# EAGLE schematic FMoto-Schematic (EAGLE 8.5.2)

## Sheet 1 of 2: HDK Interface & Identification
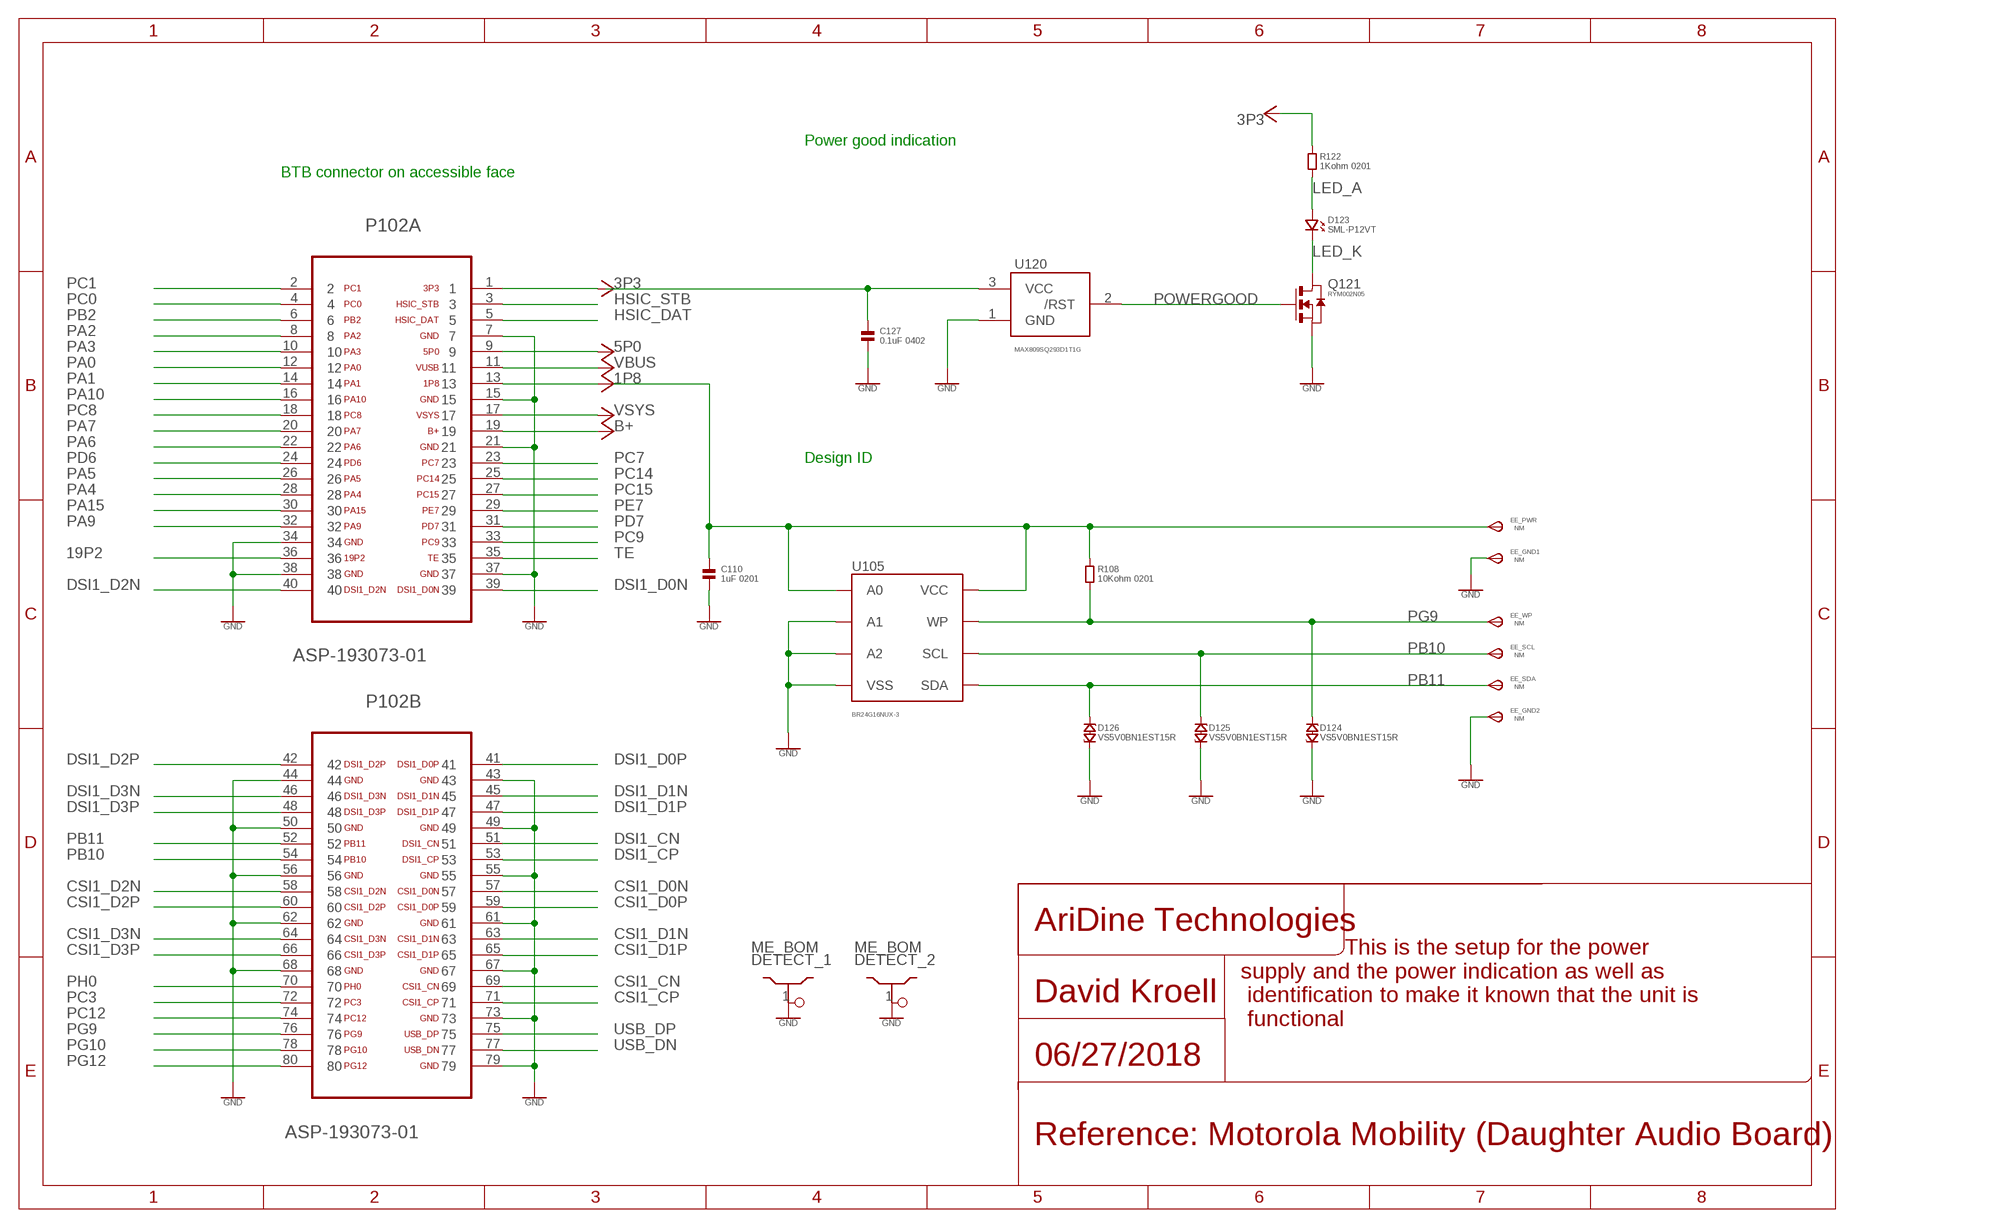
[diagram p0: schematic, sheet 1]

### Parts
C110  1uF 0201  CAPACITOR.0201  [0201]
C127  0.1uF 0402  CAPACITOR.0402  [0402]
D123  SML-P12VT  LED.0503  [0503.LED]
D124  VS5V0BN1EST15R  ESD_VARISTOR.0201  [CHIP_0201]
D125  VS5V0BN1EST15R  ESD_VARISTOR.0201  [CHIP_0201]
D126  VS5V0BN1EST15R  ESD_VARISTOR.0201  [CHIP_0201]
DETECT_1  ME_BOM  SHIELDDETECT  [PLUG]
DETECT_2  ME_BOM  SHIELDDETECT  [PLUG]
EE_GND1  NM  TPSTP11R  [TP11R]
EE_GND2  NM  TPSTP11R  [TP11R]
EE_PWR  NM  TPSTP11R  [TP11R]
EE_SCL  NM  TPSTP11R  [TP11R]
EE_SDA  NM  TPSTP11R  [TP11R]
EE_WP  NM  TPSTP11R  [TP11R]
P102  ASP-193073-01  FTMH-140-02-L-DV-ES-P-TR  [FTMH-140-02-L-DV-ES-P-TR]
Q121  RYM002N05  FET-NRYM002N05  [VMT3]
R108  10Kohm 0201  RESISTOR.0201  [0201]
R122  1Kohm 0201  RESISTOR.0201  [0201]
U105  BR24G16NUX-3  EEPROMDFN8  [DFN-8]
U120  MAX809SQ293D1T1G  MAX809  [SC70-3L]

### Nets
1P8: P102.13 ; also sheet 2
3P3: P102.1 R122.1
5P0: P102.9
19P2: P102.36
B+: P102.19 ; also sheet 2
CSI1_CN: P102.69
CSI1_CP: P102.71
CSI1_D0N: P102.57
CSI1_D0P: P102.59
CSI1_D1N: P102.63
CSI1_D1P: P102.65
CSI1_D2N: P102.58
CSI1_D2P: P102.60
CSI1_D3N: P102.64
CSI1_D3P: P102.66
DSI1_CN: P102.51
DSI1_CP: P102.53
DSI1_D0N: P102.39
DSI1_D0P: P102.41
DSI1_D1N: P102.45
DSI1_D1P: P102.47
DSI1_D2N: P102.40
DSI1_D2P: P102.42
DSI1_D3N: P102.46
DSI1_D3P: P102.48
GND: C110.2 C127.2 D124.P$2 D125.P$2 D126.P$2 DETECT_1.1 DETECT_2.1 EE_GND1.TP(PP) EE_GND2.TP(PP) P102.7 P102.15 P102.21 P102.34 P102.37 P102.38 P102.43 P102.44 P102.49 P102.50 P102.55 P102.56 P102.61 P102.62 P102.67 P102.68 P102.73 P102.79 Q121.2(S) U105.P$2(A1) U105.P$3(A2) U105.P$4(VSS) U105.P$9(VSS) U120.1(GND) ; also sheet 2
HSIC_DAT: P102.5
HSIC_STB: P102.3
LED_A: D123.P$1 R122.2
LED_K: D123.P$2 Q121.3(D)
N$1: C110.1 EE_PWR.TP(PP) R108.1 U105.P$1(A0) U105.P$8(VCC)
N$14: C127.1 U120.3(VCC)
PA0: P102.12
PA1: P102.14
PA2: P102.8
PA3: P102.10
PA4: P102.28
PA5: P102.26
PA6: P102.22
PA7: P102.20
PA9: P102.32
PA10: P102.16
PA15: P102.30
PB2: P102.6
PB10: D125.P$1 EE_SCL.TP(PP) P102.54 U105.P$6(SCL)
PB11: D126.P$1 EE_SDA.TP(PP) P102.52 U105.P$5(SDA)
PC0: P102.4 ; also sheet 2
PC1: P102.2 ; also sheet 2
PC3: P102.72
PC7: P102.23 ; also sheet 2
PC8: P102.18
PC9: P102.33
PC12: P102.74
PC14: P102.25 ; also sheet 2
PC15: P102.27 ; also sheet 2
PD6: P102.24
PD7: P102.31 ; also sheet 2
PE7: P102.29 ; also sheet 2
PG9: D124.P$1 EE_WP.TP(PP) P102.76 R108.2 U105.P$7(WP)
PG10: P102.78 ; also sheet 2
PG12: P102.80
PH0: P102.70 ; also sheet 2
POWERGOOD: Q121.1(G) U120.2(/RST)
TE: P102.35
USB_DN: P102.77
USB_DP: P102.75
VBUS: P102.11
VSYS: P102.17

### Notes on the sheet
- Power good indication
- BTB connector on accessible face
- Design ID
- AriDine Technologies
- David Kroell
- This is the setup for the power 
  supply and the power indication as well as
   identification to make it known that the unit is
   functional
- 06/27/2018
- Reference: Motorola Mobility (Daughter Audio Board)

## Sheet 2 of 2
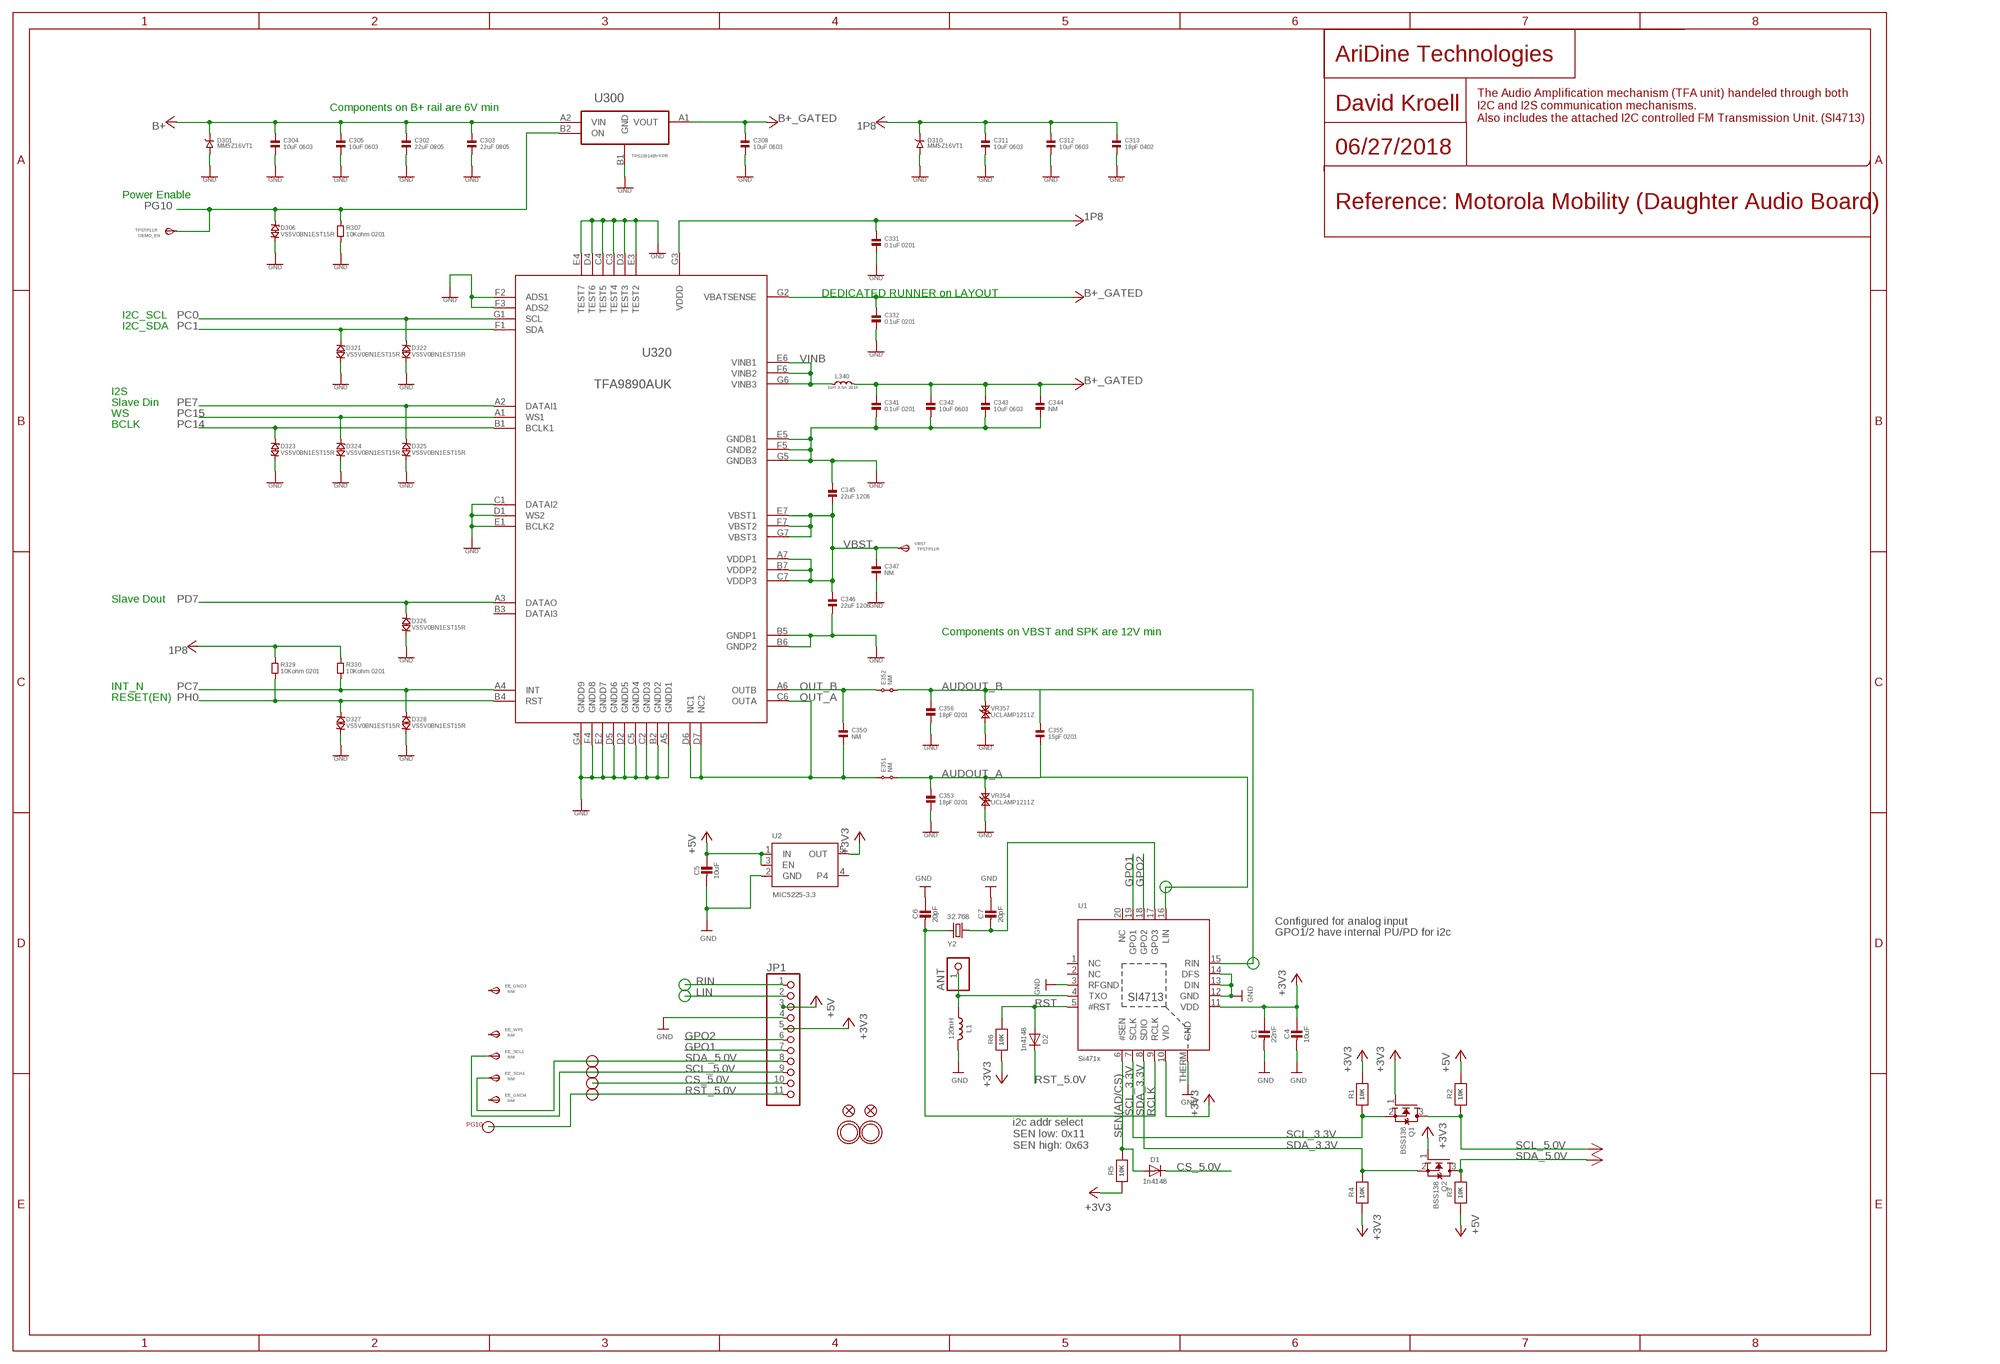
[diagram p1: schematic, sheet 2]

### Parts
ANT  PINHD-1X1  [1X01]
C1  22nF  CAP_CERAMIC0805-NOOUTLINE  [0805-NO]
C4  10uF  CAP_CERAMIC0805-NOOUTLINE  [0805-NO]
C5  10uF  CAP_CERAMIC0805-NOOUTLINE  [0805-NO]
C6  20pF  CAP_CERAMIC0805-NOOUTLINE  [0805-NO]
C7  20pF  CAP_CERAMIC0805-NOOUTLINE  [0805-NO]
C302  22uF 0805  CAPACITOR.0805  [0805]
C303  22uF 0805  CAPACITOR.0805  [0805]
C304  10uF 0603  CAPACITOR.0603  [0603]
C305  10uF 0603  CAPACITOR.0603  [0603]
C308  10uF 0603  CAPACITOR.0603  [0603]
C311  10uF 0603  CAPACITOR.0603  [0603]
C312  10uF 0603  CAPACITOR.0603  [0603]
C313  18pF 0402  CAPACITOR.0402  [0402]
C331  0.1uF 0201  CAPACITOR.0201  [0201]
C332  0.1uF 0201  CAPACITOR.0201  [0201]
C341  0.1uF 0201  CAPACITOR.0201  [0201]
C342  10uF 0603  CAPACITOR.0603  [0603]
C343  10uF 0603  CAPACITOR.0603  [0603]
C344  NM  CAPACITOR.0402  [0402]
C345  22uF 1206  CAPACITOR.1206  [1206]
C346  22uF 1206  CAPACITOR.1206  [1206]
C347  NM  CAPACITOR.0402  [0402]
C350  NM  CAPACITOR.0201  [0201]
C353  18pF 0201  CAPACITOR.0201  [0201]
C355  15pF 0201  CAPACITOR.0201  [0201]
C356  18pF 0201  CAPACITOR.0201  [0201]
D1  1n4148  DIODESOD-323  [SOD-323]
D2  1n4148  DIODESOD-323  [SOD-323]
D301  MM5Z16VT1  DIODE.SOD523  [SOD523]
D306  VS5V0BN1EST15R  ESD_VARISTOR.0201  [CHIP_0201]
D310  MM5Z16VT1  DIODE.SOD523  [SOD523]
D321  VS5V0BN1EST15R  ESD_VARISTOR.0201  [CHIP_0201]
D322  VS5V0BN1EST15R  ESD_VARISTOR.0201  [CHIP_0201]
D323  VS5V0BN1EST15R  ESD_VARISTOR.0201  [CHIP_0201]
D324  VS5V0BN1EST15R  ESD_VARISTOR.0201  [CHIP_0201]
D325  VS5V0BN1EST15R  ESD_VARISTOR.0201  [CHIP_0201]
D326  VS5V0BN1EST15R  ESD_VARISTOR.0201  [CHIP_0201]
D327  VS5V0BN1EST15R  ESD_VARISTOR.0201  [CHIP_0201]
D328  VS5V0BN1EST15R  ESD_VARISTOR.0201  [CHIP_0201]
DEMO_EN  TPSTP11R  [TP11R]
E351  NM  SHORT_BAR.0603  [0603_SHORT]
E352  NM  SHORT_BAR.0603  [0603_SHORT]
EE_GND3  NM  TPSTP11R  [TP11R]
EE_GND4  NM  TPSTP11R  [TP11R]
EE_SCL1  NM  TPSTP11R  [TP11R]
EE_SDA1  NM  TPSTP11R  [TP11R]
EE_WP1  NM  TPSTP11R  [TP11R]
FID1  FIDUCIAL""  [FIDUCIAL_1MM]
FID2  FIDUCIAL""  [FIDUCIAL_1MM]
JP1  HEADER-1X11  [1X11_ROUND]
L1  120nH  INDUCTOR_0805  [_0805]
L340  1uH 3.5A 2016  POWER-INDUCTOR.2016  [2016]
Q1  BSS138  MOSFET-NREFLOW  [SOT23]
Q2  BSS138  MOSFET-NREFLOW  [SOT23]
R1  10K  RESISTOR0805_NOOUTLINE  [0805-NO]
R2  10K  RESISTOR_0805MP  [_0805MP]
R3  10K  RESISTOR0805_NOOUTLINE  [0805-NO]
R4  10K  RESISTOR_0805MP  [_0805MP]
R5  10K  RESISTOR0805_NOOUTLINE  [0805-NO]
R6  10K  RESISTOR0805_NOOUTLINE  [0805-NO]
R307  10Kohm 0201  RESISTOR.0201  [0201]
R329  10Kohm 0201  RESISTOR.0201  [0201]
R330  10Kohm 0201  RESISTOR.0201  [0201]
U1  Si471x  SI471X  [SI471X]
U2  MIC5225-3.3  VREG_SOT23-5  [SOT23-5]
U300  TPS22914BYFPR  [BGA0_75SQ_PS0_4_P4]
U320  TFA9890AUK  [BGA7X7]
U$15  MOUNTINGHOLE2.5  [MOUNTINGHOLE_2.5_PLATED]
U$17  MOUNTINGHOLE2.5  [MOUNTINGHOLE_2.5_PLATED]
VBST  TPSTP11R  [TP11R]
VR354  UCLAMP1211Z  ESD_TVS.0201  [CHIP_0201]
VR357  UCLAMP1211Z  ESD_TVS.0201  [CHIP_0201]
Y2  32.768  CRYSTAL8.0X3.8  [CRYSTAL_8X3.8]

### Nets
1P8: C311.1 C312.1 C313.1 C331.1 D310.1 R329.1 R330.1 U320.G3(VDDD) ; also sheet 1
+3V3: C1.1 C4.1 JP1.5 Q1.1(G) Q2.1(G) R1.2 R4.1 R5.1 R6.1 U1.10(VIO) U1.11(VDD) U2.5(OUT)
+5V: C5.1 JP1.3 R2.2 R3.1 U2.1(IN) U2.3(EN)
AUDOUT_A: C353.1 C355.2 E351.2 U1.16(LIN) VR354.P$1
AUDOUT_B: C355.1 C356.1 E352.2 U1.15(RIN) VR357.P$1
B+: C302.1 C303.1 C304.1 C305.1 D301.1 U300.A2(VIN) ; also sheet 1
B+_GATED: C308.1 C332.1 C341.1 C342.1 C343.1 C344.1 L340.2 U300.A1(VOUT) U320.G2(VBATSENSE)
CS_5.0V: D1.C JP1.10
GND: C1.2 C4.2 C5.2 C6.1 C7.1 C302.2 C303.2 C304.2 C305.2 C308.2 C311.2 C312.2 C313.2 C331.2 C332.2 C341.2 C342.2 C343.2 C344.2 C345.1 C346.2 C347.2 C353.2 C356.2 D301.2 D306.P$2 D310.2 D321.P$2 D322.P$2 D323.P$2 D324.P$2 D325.P$2 D326.P$2 D327.P$2 D328.P$2 JP1.4 L1.2 R307.2 U1.3(RFGND) U1.12(GND) U1.13(DIN) U1.14(DFS) U1.THERM(GND) U2.2(GND) U300.B1(GND) U320.A5(GNDD1) U320.B2(GNDD2) U320.B5(GNDP1) U320.B6(GNDP2) U320.C1(DATAI2) U320.C2(GNDD3) U320.C3(TEST4) U320.C4(TEST5) U320.C5(GNDD4) U320.D1(WS2) U320.D2(GNDD5) U320.D3(TEST3) U320.D4(TEST6) U320.D5(GNDD6) U320.E1(BCLK2) U320.E2(GNDD7) U320.E3(TEST2) U320.E4(TEST7) U320.E5(GNDB1) U320.F2(ADS1) U320.F3(ADS2) U320.F4(GNDD8) U320.F5(GNDB2) U320.G4(GNDD9) U320.G5(GNDB3) VR354.P$2 VR357.P$2 ; also sheet 1
GPO1: JP1.7 U1.19(GPO1)
GPO2: JP1.6 U1.18(GPO2)
LIN: JP1.2
N$2: ANT.1 L1.1 U1.4(TXO)
N$4: C7.2 U1.17(GPO3) Y2.P$4
OUT_A: C350.2 E351.1 U320.C6(OUTA) U320.D6(NC1) U320.D7(NC2)
OUT_B: C350.1 E352.1 U320.A6(OUTB)
PC0: D322.P$1 U320.G1(SCL) ; also sheet 1
PC1: D321.P$1 U320.F1(SDA) ; also sheet 1
PC7: D328.P$1 R330.2 U320.A4(INT) ; also sheet 1
PC14: D323.P$1 U320.B1(BCLK1) ; also sheet 1
PC15: D324.P$1 U320.A1(WS1) ; also sheet 1
PD7: D326.P$1 U320.A3(DATAO) ; also sheet 1
PE7: D325.P$1 U320.A2(DATAI1) ; also sheet 1
PG10: D306.P$1 DEMO_EN.TP(PP) R307.1 U300.B2(ON) ; also sheet 1
PH0: D327.P$1 R329.2 U320.B4(RST) ; also sheet 1
RCLK: C6.2 U1.9(RCLK) Y2.P$1
RIN: JP1.1
RST: D2.A R6.2 U1.5(#RST)
RST_5.0V: D2.C JP1.11
SCL_3.3V: Q1.2(S) R1.1 U1.7(SCLK)
SCL_5.0V: EE_SCL1.TP(PP) JP1.9 Q1.3(D) R2.1
SDA_3.3V: Q2.2(S) R4.2 U1.8(SDIO)
SDA_5.0V: EE_SDA1.TP(PP) JP1.8 Q2.3(D) R3.2
SEN(AD/CS): D1.A R5.2 U1.6(#SEN)
VBST: C345.2 C346.1 C347.1 U320.A7(VDDP1) U320.B7(VDDP2) U320.C7(VDDP3) U320.E7(VBST1) U320.F7(VBST2) U320.G7(VBST3) VBST.TP(PP)
VINB: L340.1 U320.E6(VINB1) U320.F6(VINB2) U320.G6(VINB3)
Unconnected: EE_GND3.TP(PP) EE_GND4.TP(PP) EE_WP1.TP(PP) U1.1(NC) U1.2(NC) U1.20(NC) U2.4 U320.B3(DATAI3)

### Notes on the sheet
- AriDine Technologies
- Components on B+ rail are 6V min | David Kroell
- The Audio Amplification mechanism (TFA unit) handeled through both
  I2C and I2S communication mechanisms. 
  Also includes the attached I2C controlled FM Transmission Unit. (SI4713)
- 06/27/2018
- Power Enable
- Reference: Motorola Mobility (Daughter Audio Board)
- DEDICATED RUNNER on LAYOUT
- I2C_SCL
- I2C_SDA
- I2S
- Slave Din
- WS
- BCLK
- Slave Dout
- Components on VBST and SPK are 12V min
- INT_N
- RESET(EN)
- Configured for analog input
- GPO1/2 have internal PU/PD for i2c
- SI4713
- PG10
- i2c addr select
  SEN low: 0x11
  SEN high: 0x63

## Library data of the parts
ANT = adafruit:PINHD-1X1: Pin header 1x1 for 0.1" spacing With round pins
C1 C4-C7 = microbuilder:CAP_CERAMIC: Ceramic Capacitors For new designs, use the packages preceded by an '_' character since they are more reliable: The following footprints should be used on most boards: _0402 - Standard footprint for regular board layouts _0603 - Standard footprint for regular board layouts _0805 - Standard footprint for regular board layouts _1206 - Standard footprint for regular board layouts For extremely tight-pitch boards where space is at a premium, the following 'micro-pitch' footprints can be used (smaller pads, no silkscreen outline, etc.): _0402MP - Micro-pitch footprint for very dense/compact boards _0603MP - Micro-pitch footprint for very dense/compact boards _0805MP - Micro-pitch footprint for very dense/compact boards _1206MP - Micro-pitch footprint for very dense/compact boards
C110 C127 C302-C305 C308 C311-C313 C331 C332 C341-C347 C350 C353 C355 C356 = MOTO_LIB:CAPACITOR: Ceramic Capacitor, Generic
D1 D2 = microbuilder:DIODE: Diode SMA Model Volts Amps Type Vf Ir Digikey # Notes SSA34-E3 40V 3A Schottky 480mV @ 3A 200uA @ 40V SSA34-E3/61TGITR-ND CDBA120-G 20V 1A Schottky 500mV @ 1A 500uA @ 20V 641-1014-6-ND REEL MBRA210 10V 2A Schottky 350mV @ 2A 700uA @ 10V MBRA210LT3 SOD-123 Model Volts Amps Type Vf Ir Order # Notes BAT54T1G 30V 200mA Schottky 800mV @ 200mA 2uA @ 25V BAT54T1GOSTR-ND B0530W 30V 500mA Schottky 430mV @ 500mA 130uA @ 30V B0530W-FDICT-ND REEL MBR120 20V 1A Schottky 340mV @ 1A MBR120VLSFT1GOSCT-ND SOD-323 Model Volts Amps Type Vf Ir Order # Notes PMEG2005EJ 20V 500mA Schottky 355mV @ 500mA 568-4110-1-ND ZLLS410 10V 570mA Schottky 380mV @ 570mA ZLLS410CT-ND 1N4148WS 75V 150mA Silicon/Simple 1V 1N4148WSFSCT-ND REEL SOD-523 Model Volts Amps Type Vf Ir Order # Notes BAT54XV2 30V 200mA Schottky 0.8V @ 100mA BAT54XV2CT-ND TB751S 30V 30mA Schottky RB751S-40TE61CT-ND SOT23-R/W (R = Solder Paste/Reflow Ovens, W = Hand-Soldering) Model Volts Amps Type Vf Ir Order # Notes BAT54FILM 40V 300mA Schottky 497-7162-1-ND POWERDI-5 Model Volts Amps Type Vf Ir Order # Notes PDS560 60V 5A Schottky 670mV @ 5A 150uA @ 60V PDS560DICT-ND
D123 = MOTO_LIB:LED: LED GENERIC, single, 2 pin; MPN: SML-P12VT; SUPPLIER: ROHM
D124-D126 D306 D321-D328 = MOTO_LIB:ESD_VARISTOR: GENERIC varistor,single, 2 pin; MPN: VS5V0BN1EST15R; SUPPLIER: ROHM
D301 D310 = MOTO_LIB:DIODE: DIODE GENERIC, single, 2 pin; MPN: MM5Z16VT1; SUPPLIER: ON_SEMI
DEMO_EN EE_GND1-EE_GND4 EE_PWR EE_SCL EE_SCL1 EE_SDA EE_SDA1 EE_WP EE_WP1 VBST = MOTO_LIB:TPS: TEST Point, 1mm diameter, gold
DETECT_1 DETECT_2 = MOTO_LIB:SHIELD: Shield, Custom; MPN: refer to ME BOM; SUPPLIER: ref to ME BOM
E351 E352 = MOTO_LIB:SHORT_BAR: SHORT BAR - layout feature
FID1 FID2 = microbuilder:FIDUCIAL: Fiducial Alignment Points Various fiducial points for machine vision alignment.; BOM: EXCLUDE
JP1 = microbuilder:HEADER-1X11
L1 = microbuilder:INDUCTOR: Inductors 0603: 10nH Ceramic Inductor - microwire antenna/RF (Digikey: 712-1434-2-ND) 0805: 560nH Ceramic Inductor - RF (Digikey: 553-1047-1-ND) 270nH Ceramic Inductor - Q = 40@250MHz, +-5%, 1 Ohm DC Resistance (Digikey: 535-10506-2-ND) 1007 (2518 Metric) SMT: 10µH 10% 250mOhm 820mA 1007 Inductor (Digikey: 587-2189-1-ND) 22µH 10% 500mOhm 580mA 1007 Inductor (Digikey: 587-2190-1-ND) 47µH 10% 950mOhm 420mA 1007 Inductor (Digikey: 587-2191-1-ND) 47µH 5% 100mOhm 1A 1008 Inductor (Digikey: 732-1816-1-ND) 5.0x5.0mm (Taiyo Yuden NR5040 Series) 6.8µH 20% 2.3A 64mOhm Inductor (Digikey: 587-2374-2-ND) 5.0x5.0mm (TDK VLC5045 Series) 4.7µH 20% 3.3A 34mOhm Inductor (Digikey: 445-6526-1-ND) 6.8µH 20% 2.7A 46mOhm Inductor (Digikey: 445-6527-1-ND) 6.0x6.0mm (TDK VLC6045 Series) 4.7µH 20% 3.8A 27mOhm Inductor (Digikey: 445-6538-2-ND) 6.8µH 20% 3A 41mOhm Inductor (Digikey: 445-6540-1-ND) 6.2µH 30% 2.2A 45mOhm Inductor (Digikey: SRR5028-6R2YCT-ND) - Not TDK VLC6045 but footprint should match 6.0x6.0mm (TDK SLF6045 Series) 6.8uH 30% 2A 33mOhm Inductor (Digikey: 445-4572-1-ND, Mouser: 810-SLF645T6R8N2R0PF) 6.0x6.0mm (Sumida CDRH5D28 Series) 6.2uH 30% 1.8A 45mOhm Inductor (Digikey: 308-1542-1-ND) Taiyo Yuden NR3015T2R2M - 2.2uH 20% 1.5A (Digikey: 587-1648-2-ND, Mouser: 963-NR3015T2R2M) - Used with TI TPS62172 CoilCraft RFID Transponder Coil - MA5532-AE (For use with AS3935 Lightning Sensor)
L340 = MOTO_LIB:POWER-INDUCTOR: Inductor, Power
P102 = MOTO_LIB:FTMH-140-02-L-DV-ES-P-TR: MICRO SOCKET, 1.0MM, SMD, 2X40WAY, MALE; MPN: ASP-193073-01; SUPPLIER: SAMTEC
Q1 Q2 = adafruit:MOSFET-N: N-Channel Mosfet 2N7002E - 60V 260mA SOT23 [Digikey: 2N7002ET1GOSTR-ND] - REEL BSH103 - 30V 850mA SOT23 [Digikey: 568-5013-1-ND]
Q121 = MOTO_LIB:FET-N: Generic NMOS FET; MPN: RYM002N05; SUPPLIER: ROHM
R1-R6 = microbuilder:RESISTOR: Resistors For new designs, use the packages preceded by an '_' character since they are more reliable: The following footprints should be used on most boards: _0402 - Standard footprint for regular board layouts _0603 - Standard footprint for regular board layouts _0805 - Standard footprint for regular board layouts _1206 - Standard footprint for regular board layouts For extremely tight-pitch boards where space is at a premium, the following 'micro-pitch' footprints can be used (smaller pads, no silkscreen outline, etc.): _0402MP - Micro-pitch footprint for very dense/compact boards _0603MP - Micro-pitch footprint for very dense/compact boards _0805MP - Micro-pitch footprint for very dense/compact boards _1206MP - Micro-pitch footprint for very dense/compact boards
R108 R122 R307 R329 R330 = MOTO_LIB:RESISTOR: Resistor - Generic
U1 = microbuilder:SI471X: Si4712/13 FM Radio Transmitter and Receiver VDD: 2.7-5.5V FM Band: 76-108MHz
U2 = microbuilder:VREG_SOT23-5: SOT23-5 Fixed Voltage Regulators Part Current Out V Out V In V Dropout θJA (°C/W) TJ (°C) Digikey Part No. ADP121 150mA 3.3V 3.4-5.5V 0.09V @ 150mA -- -- ADP121-AUJZ33R7CT-ND ADP121 150mA 3.0V 3.1-5.5V 0.09V @ 150mA -- -- ADP121-AUJZ30R7CT-ND ADP122 300mA 3.3V 3.4-5.5V 0.085V @ 300mA -- -- ADP122AUJZ-3.3-R7CT-ND ADP1712 300mA 3.3V 3.5-5.5V 0.17V @ 300mA -- -- ADP1712AUJZ-3.3-R7TR-ND AP7311 (Low Cost) 150mA 3.3V 3.5-6V 0.15V @ 150mA -- -- AP7311-33WG-7DICT-ND LD39015M18R 150mA 1.8V 1.9V-5.5V 0.08V @ 100mA -- -- 497-6977-1-ND LP2985A-33DBVR 150mA 3.3V 3.3-16V 0.28V @ 150mA 206 150 296-18479-1-ND MCP1824T-3302E/OT 300mA 3.3V 3.5V-6V 0.2V @ 300mA -- -- MCP1824T-3302E/OTCT-ND MIC5205-2.5YM5 TR 150mA 2.5V 2.7-16V 0.165V @ 150mA -- -- 576-1257-2-ND MIC5205-3.0YM5 TR 150mA 3.0V 3.2V-16V 0.165V @ 150mA -- -- 576-1258-2-ND MIC5205-3.3YM5 TR 150mA 3.3V 3.5V-16V 0.165V @ 150mA -- -- 576-1259-2-ND TPS780330220 150mA 3.3V+2.2V 3.6-5.5V 250mV Max -- -- 296-23332-1-ND TDA3663/N1,135 100mA 3.3V 3.5-45V 0.18V @ 50mA -- -- 568-5343-1-ND Max operating temp can be calculated using θJA, TJ (max junction temperature), and power in watts. Set the "Maximum Ambient Temperature" until it reaches TJ ("Max Junction Temperature"), which is the absolute limit for safe use of the regulator: Heat Sink Temperature Calculator <http://www.daycounter.com/Calculators/Heat-Sink-Temperature-Calculator.phtml> For example, With 12V source into a 3.3V LP2985 and a 30mA load, we are dissipating (12V-3.3V) * 0.03A = 0.261W. With a θJA of 206 °C/W, a TJ of 150°C, and 261mW we can safely use the chip without a heat sink up to 75°C (=147.1°C Junction Temperature).
U105 = MOTO_LIB:EEPROM: I2C EE PROM, 8 pin; MPN: BR24G16NUX-3; SUPPLIER: ROHM
U120 = MOTO_LIB:MAX809: 3-Pin Microprocessor Reset Circuit; MPN: MAX809SQ293D1T1; SUPPLIER: ON-SEMI
U300 = MOTO_LIB:TPS22914BYFPR: 5V load switch; MPN: TPS22914BYFPR; SUPPLIER: TI
U320 = MOTO_LIB:TFA9890AUK: Audio Power amplifier; MPN: TFA9890AUK; SUPPLIER: NXP
U$15 U$17 = microbuilder:MOUNTINGHOLE: Mounting Hole For #2 screws (0.086"/2.18mm width, 0.094"/2.4mm hole) use 2.5mm; BOM: EXCLUDE
VR354 VR357 = MOTO_LIB:ESD_TVS: GENERIC TVS,single, 2 pin; MPN: UCLAMP1211Z; SUPPLIER: SEMTECH
Y2 = microbuilder:CRYSTAL: Crystals HC49UP - Surface Mount Crystal 4.0MHz 18pF +/-30ppm Surface Mount Crystal [Digikey: 535-9857-1-ND] 12.0 MHz Surface Mount Crystal [Digikey: 535-9869-6-ND] 25.0 MHz Surface Mount Crystal [Digikey: 535-9078-1-ND] 2.5 x 2.0mm - MEMs SMT Crystal 16.0 MHz 10pF 20ppm 2.5 x 2.0mm Crystal [Digikey -40-85°C: 535-10923-1-ND] 3.2 x 2.5mm - MEMs SMT Crystal 12.0 MHz 8pF 15ppm 3.2 x 2.5mm Crystal [Digikey: -10-70°C: 644-1047-1-ND -40-125°C: 644-1128-1-ND] 40~85°C cheaper: 644-1173-6-ND 16.0 MHz 8pF 15ppm 3.2 x 2.5mm Crystal [Digikey: -10-70°C: 644-1049-1-ND -40-125°C: 644-1129-2-ND]-40~85°C cheaper: 644-1175-6-ND 16.0 MHz 10pF 10ppm 3.2 x 2.5mm Crystal [Digikey: 644-1100-1-ND] 27.12 MHz 18pF 30ppm 3.2 x 2.5mm Crystal [Digikey: 887-1424-1-ND] 27.12MHz 10pF 10ppm 3.2 x 2.5mm Crystal [Digikey: 887-1329-1-ND] 4.9 x 1.8mm - MEMs SMT Crystal 32.768 KHz 12.5pF 20ppm 4.9 x 1.8mm Crystal [Digikey: SE2415CT-ND] 8.0 x 3.8mm - Surface Mount Crystal 32.768kHz 12.5pF 20ppm -40°C-85°C [Digikey: 535-9166-2-ND] Cylinder 32.768KHz Cylinder Crystal (2x6mm body) [Ex. Digikey: 300-8341-2-ND]